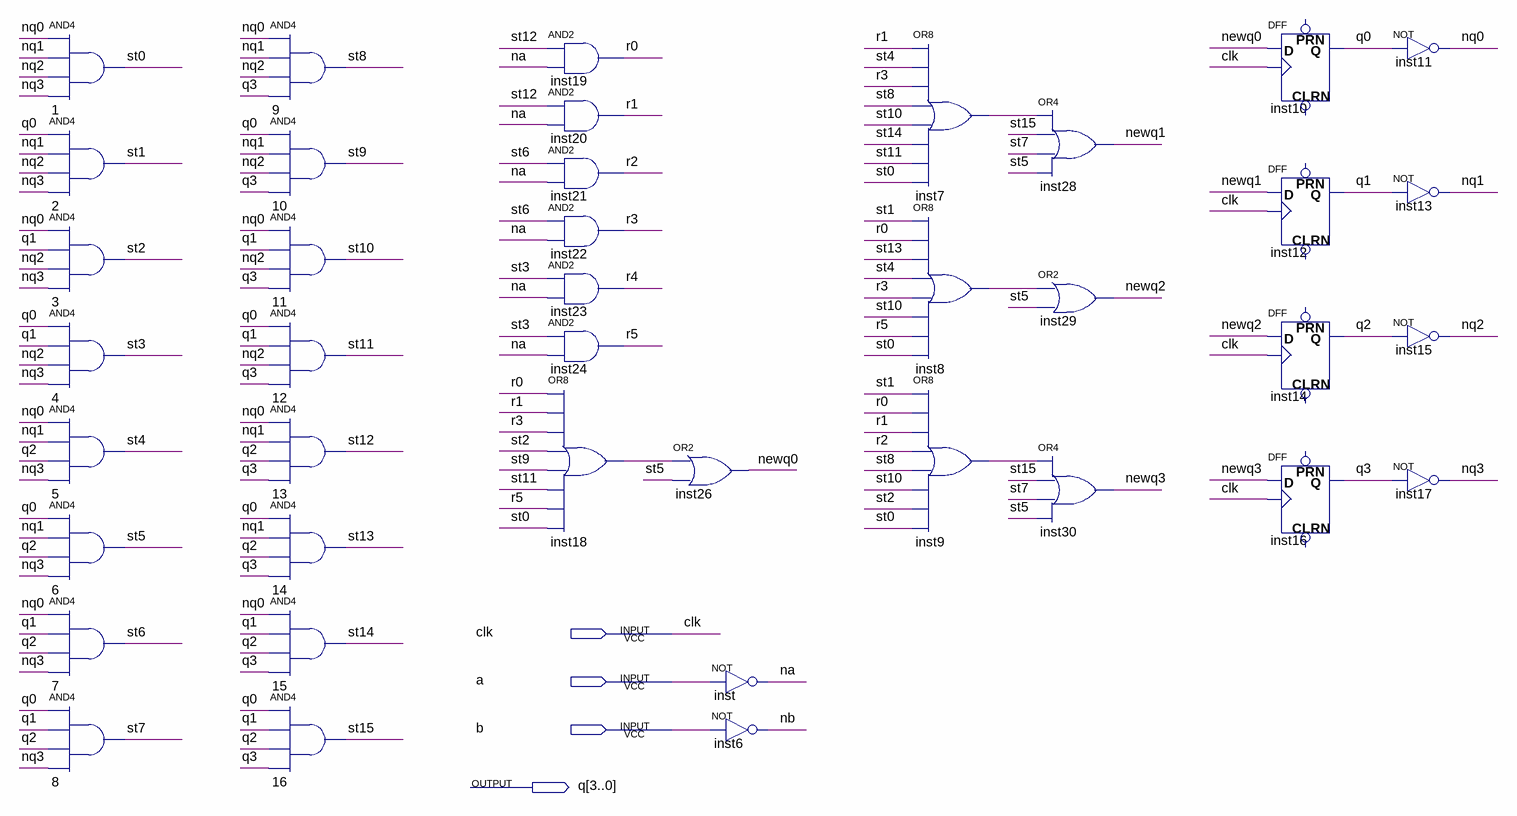
[diagram p0: schematic sheet]
// Quartus schematic practika6.bdf as structural Verilog: 40 symbols, 4 pins
module practika6 (
  input  clk,
  input  a,
  input  b,
  output [3:0] q
);

  wire inst7_out, inst8_out, inst9_out, inst18_out, na, nb, newq0, newq1, newq2, newq3, nq0, nq1, nq2, nq3,
       r0, r1, r2, r3, r4, r5, st0, st1, st2, st3, st4, st5, st6, st7, st8, st9, st10, st11, st12, st13,
       st14, st15;

  and u_1 (st0, nq0, nq1, nq2, nq3);
  and u_2 (st1, q[0], nq1, nq2, nq3);
  and u_3 (st2, nq0, q[1], nq2, nq3);
  and u_4 (st3, q[0], q[1], nq2, nq3);
  and u_5 (st4, nq0, nq1, q[2], nq3);
  and u_6 (st5, q[0], nq1, q[2], nq3);
  and u_7 (st6, nq0, q[1], q[2], nq3);
  and u_8 (st7, q[0], q[1], q[2], nq3);
  and u_9 (st8, nq0, nq1, nq2, q[3]);
  and u_10 (st9, q[0], nq1, nq2, q[3]);
  and u_11 (st10, nq0, q[1], nq2, q[3]);
  and u_12 (st11, q[0], q[1], nq2, q[3]);
  and u_13 (st12, nq0, nq1, q[2], q[3]);
  and u_14 (st13, q[0], nq1, q[2], q[3]);
  and u_15 (st14, nq0, q[1], q[2], q[3]);
  and u_16 (st15, q[0], q[1], q[2], q[3]);
  and inst19 (r0, st12, na);
  and inst20 (r1, st12, na);
  and inst21 (r2, st6, na);
  and inst22 (r3, st6, na);
  and inst23 (r4, st3, na);
  and inst24 (r5, st3, na);
  or inst18 (inst18_out, r0, r1, r3, st2, st9, st11, r5, st0);
  or inst26 (newq0, inst18_out, st5);
  not inst (na, a);
  not inst6 (nb, b);
  or inst7 (inst7_out, r1, st4, r3, st8, st10, st14, st11, st0);
  or inst8 (inst8_out, st1, r0, st13, st4, r3, st10, r5, st0);
  or inst9 (inst9_out, st1, r0, r1, r2, st8, st10, st2, st0);
  or inst28 (newq1, inst7_out, st15, st7, st5);
  or inst29 (newq2, inst8_out, st5);
  or inst30 (newq3, inst9_out, st15, st7, st5);
  DFF inst10 (.CLK(clk), .D(newq0), .Q(q[0]));  // open: CLRN, PRN
  DFF inst12 (.CLK(clk), .D(newq1), .Q(q[1]));  // open: CLRN, PRN
  DFF inst14 (.CLK(clk), .D(newq2), .Q(q[2]));  // open: CLRN, PRN
  DFF inst16 (.CLK(clk), .D(newq3), .Q(q[3]));  // open: CLRN, PRN
  not inst11 (nq0, q[0]);
  not inst13 (nq1, q[1]);
  not inst15 (nq2, q[2]);
  not inst17 (nq3, q[3]);
endmodule
